# EAGLE design main (EAGLE 9.2.2)
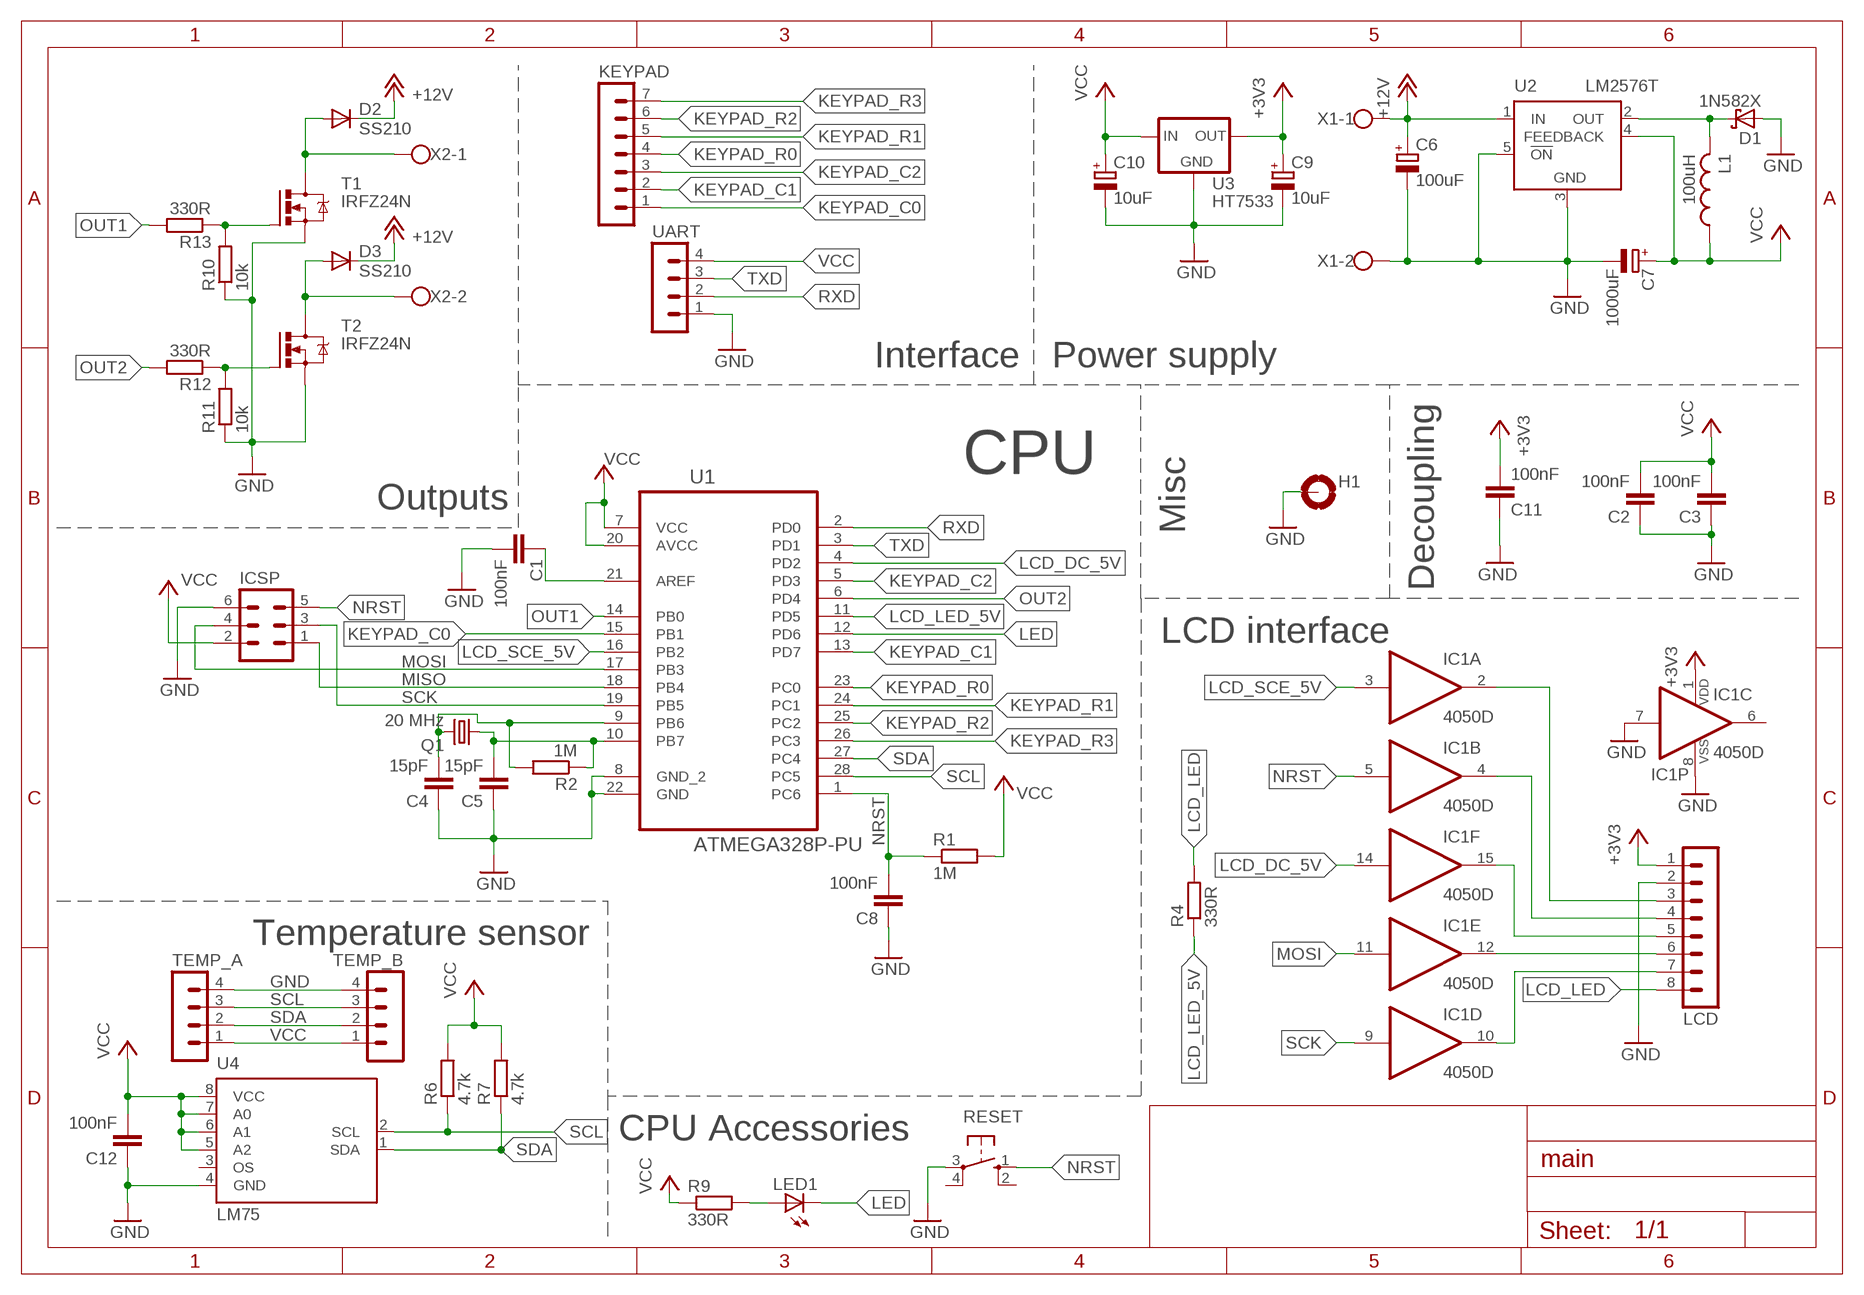
[diagram p0: schematic, sheet 1]

## Parts
C1  100nF  C-EUC0805  [C0805]
C2  100nF  C-EUC0805  [C0805]
C3  100nF  C-EUC0805  [C0805]
C4  15pF  C-EUC0805  [C0805]
C5  15pF  C-EUC0805  [C0805]
C6  100uF  CPOL-EUTAP5-80  [TAP5-80]
C7  1000uF  CPOL-EUTT5D10  [TT5D10]
C8  100nF  C-EUC0805  [C0805]
C9  10uF  CPOL-EUC  [PANASONIC_C]
C10  10uF  CPOL-EUC  [PANASONIC_C]
C11  100nF  C-EUC0805  [C0805]
C12  100nF  C-EUC0805  [C0805]
D1  1N582X  [DIODE5MM]
D2  SS210  DIODE-SMB  [SMB]
D3  SS210  DIODE-SMB  [SMB]
H1  MOUNT-PAD-ROUND3.6  [3,6-PAD]
IC1  4050D  [SO16]
ICSP  MA03-2  [MA03-2]
KEYPAD  MA07-1  [MA07-1]
L1  100uH  L-USTJ3-U1  [TJ3-U1]
LCD  MA08-1  [MA08-1]
LED1  LED5MM  [LED5MM]
Q1  20 MHz  CRYSTALHC49S  [HC49/S]
R1  1M  R-EU_R0805  [R0805]
R2  1M  R-EU_R0805  [R0805]
R4  330R  R-EU_R0805  [R0805]
R6  4.7k  R-EU_R0805  [R0805]
R7  4.7k  R-EU_R0805  [R0805]
R9  330R  R-EU_R0805  [R0805]
R10  10k  R-EU_R0805  [R0805]
R11  10k  R-EU_R0805  [R0805]
R12  330R  R-EU_R0805  [R0805]
R13  330R  R-EU_R0805  [R0805]
RESET  10-XX  [B3F-10XX]
T1  IRFZ24N  [TO220AB]
T2  IRFZ24N  [TO220AB]
TEMP_A  MA04-1  [MA04-1]
TEMP_B  MA04-1  [MA04-1]
U1  ATMEGA328P-PU  [DIP254P762X457-28]
U2  LM2576T  [TO220-5]
U3  HT7533  LE33CZ  [TO-92]
U4  LM75  [SOIC8]
UART  MA04-1  [MA04-1]
X1  W237-102  [W237-102]
X2  W237-102  [W237-102]

## Nets
+3V3: C9.+ C11.2 IC1.1(P:VDD) LCD.1 U3.3(OUT)
+12V: C6.+ D2.C D3.C U2.1(IN) X1.1
GND: C1.2 C2.1 C3.1 C4.1 C5.1 C6.- C7.- C8.1 C9.- C10.- C11.1 C12.1 D1.A H1.B3,6(MOUNT) IC1.7(C:I) IC1.8(P:VSS) ICSP.6 LCD.2 R10.1 R11.1 RESET.3(P) T1.S T2.S TEMP_A.4 TEMP_B.4 U1.8(GND_2) U1.22(GND) U2.3(GND) U2.5(!ON) U3.1(GND) U4.4(GND) UART.1 X1.2
KEYPAD_C0: KEYPAD.1 U1.15(PB1)
KEYPAD_C1: KEYPAD.2 U1.13(PD7)
KEYPAD_C2: KEYPAD.3 U1.5(PD3)
KEYPAD_R0: KEYPAD.4 U1.23(PC0)
KEYPAD_R1: KEYPAD.5 U1.24(PC1)
KEYPAD_R2: KEYPAD.6 U1.25(PC2)
KEYPAD_R3: KEYPAD.7 U1.26(PC3)
LCD_DC: IC1.15(F:O) LCD.5
LCD_DC_5V: IC1.14(F:I) U1.4(PD2)
LCD_LED: LCD.8 R4.2
LCD_LED_5V: R4.1 U1.11(PD5)
LCD_MOSI: IC1.12(E:O) LCD.6
LCD_RST: IC1.4(B:O) LCD.4
LCD_SCE: IC1.2(A:O) LCD.3
LCD_SCE_5V: IC1.3(A:I) U1.16(PB2)
LCD_SCK: IC1.10(D:O) LCD.7
LED: LED1.K(C) U1.12(PD6)
MISO: ICSP.1 U1.18(PB4)
MOSI: IC1.11(E:I) ICSP.4 U1.17(PB3)
N$1: C1.1 U1.21(AREF)
N$3: C5.2 Q1.1 R2.1 U1.10(PB7)
N$4: C4.2 Q1.2 R2.2 U1.9(PB6)
N$6: LED1.A R9.2
N$9: R10.2 R13.1 T1.G
N$12: R11.2 R12.1 T2.G
NRST: C8.2 IC1.5(B:I) ICSP.5 R1.1 RESET.1(S) U1.1(PC6)
OUT1: R13.2 U1.14(PB0)
OUT1_OC: D2.A T1.D X2.1
OUT2: R12.2 U1.6(PD4)
OUT2_OC: D3.A T2.D X2.2
OUT_5V: D1.C L1.2 U2.2(OUT)
RXD: U1.2(PD0) UART.2
SCK: IC1.9(D:I) ICSP.3 U1.19(PB5)
SCL: R6.1 TEMP_A.3 TEMP_B.3 U1.28(PC5) U4.2(SCL)
SDA: R7.1 TEMP_A.2 TEMP_B.2 U1.27(PC4) U4.1(SDA)
TXD: U1.3(PD1) UART.3
VCC: C2.2 C3.2 C7.+ C10.+ C12.2 ICSP.2 L1.1 R1.2 R6.2 R7.2 R9.1 TEMP_A.1 TEMP_B.1 U1.7(VCC) U1.20(AVCC) U2.4(FEEDBACK) U3.2(IN) U4.5(A2) U4.6(A1) U4.7(A0) U4.8(VCC) UART.4
Unconnected: IC1.6(C:O) RESET.2(S1) RESET.4(P1) U4.3(OS)

## Notes on the sheet
- Interface | Power supply
- Decoupling
- Misc
- CPU
- Outputs
- LCD interface
- Temperature sensor
- CPU Accessories

## Library data of the parts
C1-C5 C8 C11 C12 = rcl:C-EU: CAPACITOR, European symbol
C6 C7 C9 C10 = rcl:CPOL-EU: POLARIZED CAPACITOR, European symbol
D1 = misc:1N582X
D2 D3 = diode:DIODE-: DIODE
H1 = holes:MOUNT-PAD-ROUND: MOUNTING PAD, round
IC1 = 40xx:4050: Hex non-inverting BUFFER
ICSP = con-lstb:MA03-2: PIN HEADER; OC_FARNELL: unknown; OC_NEWARK: unknown
KEYPAD = con-lstb:MA07-1: PIN HEADER; OC_FARNELL: unknown; OC_NEWARK: unknown
L1 = rcl:L-US: INDUCTOR, American symbol
LCD = con-lstb:MA08-1: PIN HEADER; OC_FARNELL: unknown; OC_NEWARK: unknown
LED1 = led:LED: LED OSRAM: - CHIPLED LG R971, LG N971, LY N971, LG Q971, LY Q971, LO R971, LY R971 LH N974, LH R974 LS Q976, LO Q976, LY Q976 LO Q996 - Hyper CHIPLED LW Q18S LB Q993, LB Q99A, LB R99A - SideLED LS A670, LO A670, LY A670, LG A670, LP A670 LB A673, LV A673, LT A673, LW A673 LH A674 LY A675 LS A676, LA A676, LO A676, LY A676, LW A676 LS A679, LY A679, LG A679 - Hyper Micro SIDELED® LS Y876, LA Y876, LO Y876, LY Y876 LT Y87S - SmartLED LW L88C, LW L88S LB L89C, LB L89S, LG L890 LS L89K, LO L89K, LY L89K LS L896, LA L896, LO L896, LY L896 - TOPLED LS T670, LO T670, LY T670, LG T670, LP T670 LSG T670, LSP T670, LSY T670, LOP T670, LYG T670 LG T671, LOG T671, LSG T671 LB T673, LV T673, LT T673, LW T673 LH T674 LS T676, LA T676, LO T676, LY T676, LB T676, LH T676, LSB T676, LW T676 LB T67C, LV T67C, LT T67C, LS T67K, LO T67K, LY T67K, LW E67C LS E67B, LA E67B, LO E67B, LY E67B, LB E67C, LV E67C, LT E67C LW T67C LS T679, LY T679, LG T679 LS T770, LO T770, LY T770, LG T770, LP T770 LB T773, LV T773, LT T773, LW T773 LH T774 LS E675, LA E675, LY E675, LS T675 LS T776, LA T776, LO T776, LY T776, LB T776 LHGB T686 LT T68C, LB T68C - Hyper Mini TOPLED® LB M676 - Mini TOPLED Santana® LG M470 LS M47K, LO M47K, LY M47K Source: http://www.osram.convergy.de LUXEON: - LUMILED® LXK2-PW12-R00, LXK2-PW12-S00, LXK2-PW14-U00, LXK2-PW14-V00 LXK2-PM12-R00, LXK2-PM12-S00, LXK2-PM14-U00 LXK2-PE12-Q00, LXK2-PE12-R00, LXK2-PE12-S00, LXK2-PE14-T00, LXK2-PE14-U00 LXK2-PB12-K00, LXK2-PB12-L00, LXK2-PB12-M00, LXK2-PB14-N00, LXK2-PB14-P00, LXK2-PB14-Q00 LXK2-PR12-L00, LXK2-PR12-M00, LXK2-PR14-Q00, LXK2-PR14-R00 LXK2-PD12-Q00, LXK2-PD12-R00, LXK2-PD12-S00 LXK2-PH12-R00, LXK2-PH12-S00 LXK2-PL12-P00, LXK2-PL12-Q00, LXK2-PL12-R00 Source: www.luxeon.com KINGBRIGHT: KA-3528ASYC Source: www.kingbright.com
Q1 = crystal:CRYSTAL: CRYSTAL; OC_FARNELL: 1667008; OC_NEWARK: unknown
R1 R2 R4 R6 R7 R9-R13 = rcl:R-EU_: RESISTOR, European symbol
RESET = switch-omron:10-XX: OMRON SWITCH; MPN: B3F-1000; OC_FARNELL: 176432; OC_NEWARK: 36M3542
T1 T2 = misc:IRFZ24N
TEMP_A TEMP_B UART = con-lstb:MA04-1: PIN HEADER; OC_FARNELL: unknown; OC_NEWARK: unknown
U1 = ATMEGA328P-PU:ATMEGA328P-PU: 8-bit Microcontroller with In-System Programmable Flash; MPN: ATMEGA328P-PU; OC_FARNELL: 1715487; OC_NEWARK: 15R0268; PACKAGE: PDIP-28; SUPPLIER: Atmel
U2 = misc:LM2576T
U3 = v-reg:LE33CZ
U4 = misc:LM75
X1 X2 = con-wago-500:W237-102: WAGO SCREW CLAMP; MPN: 237-102; OC_FARNELL: unknown; OC_NEWARK: 70K9898

## Board
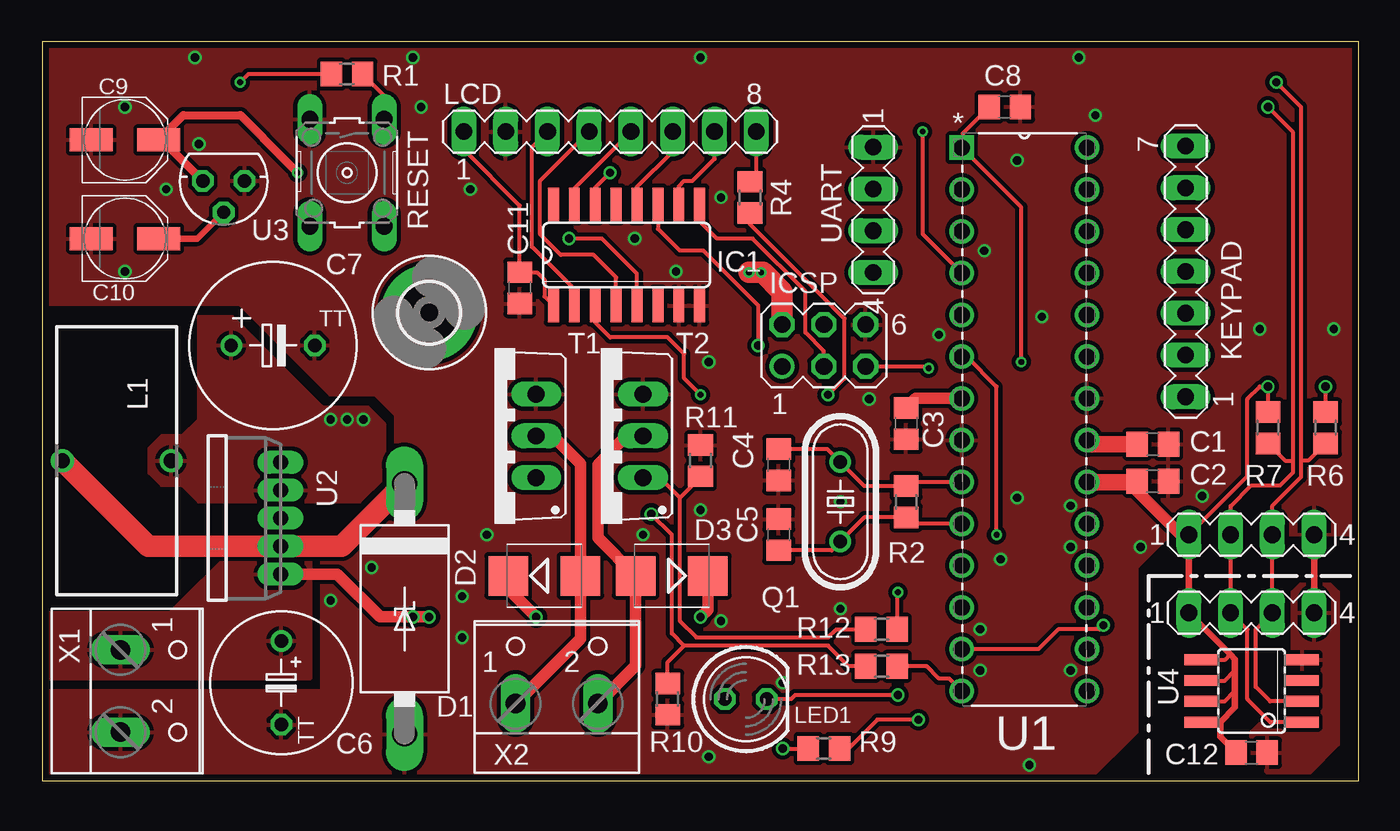
[diagram p1: board, top side]
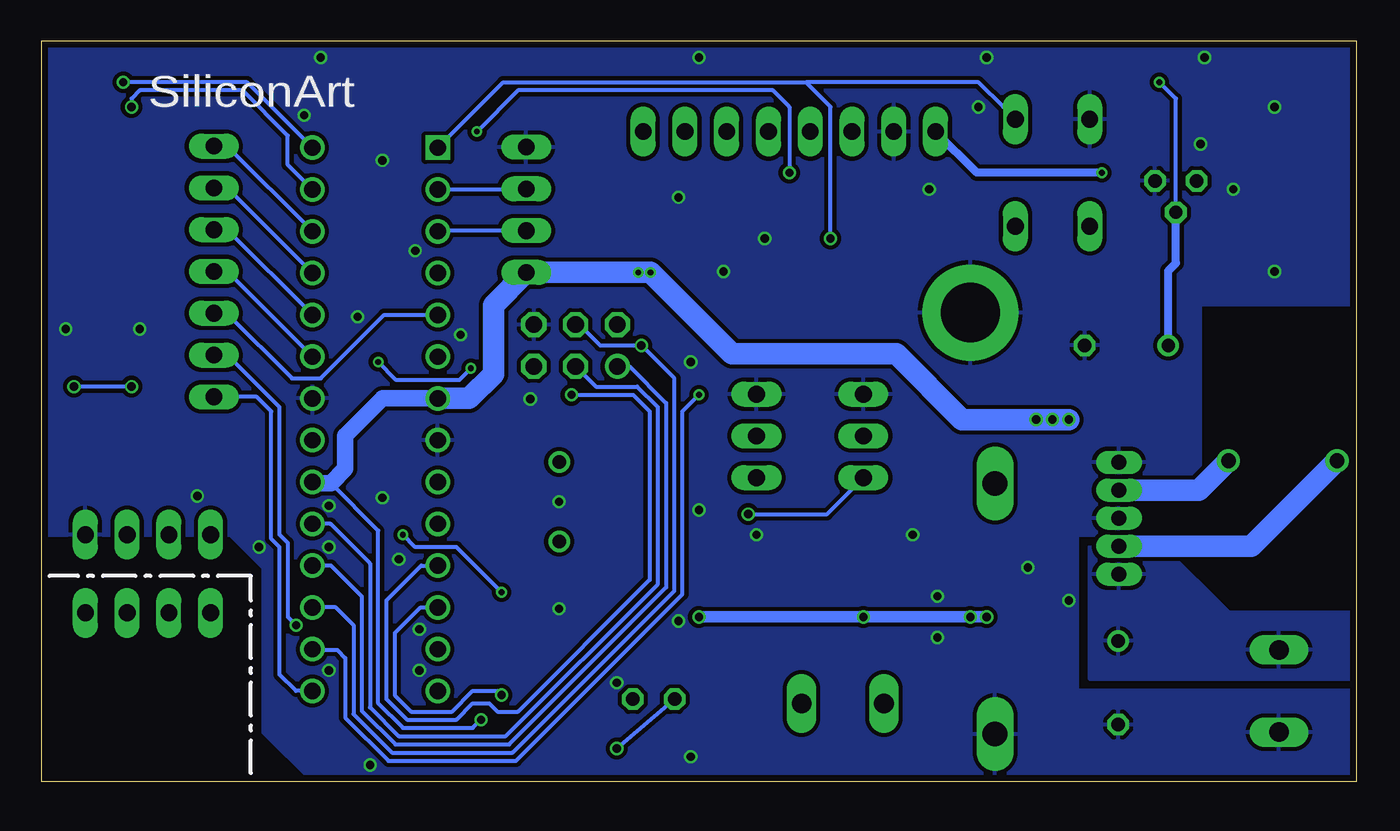
[diagram p2: board, bottom side, seen from below]

Size 80 x 45 mm. Coordinates in mm from the lower left corner, seen from the top.
Outline: 0,0 0,45 80,45 80,0 0,0
Copper layers (1*16): Top 0.035mm / dielectric 1.6mm / Bottom 0.035mm
Design rules "iteadstudio": minimum track width 0.2mm, minimum drill 0.3mm, track to track 0.25mm, track to pad 0.25mm, pad to pad 0.25mm, via to via 0.25mm, smd to smd 0.15mm, copper to edge 0.4mm, drill to drill 0.25mm, minimum pad ring 0.25mm, minimum via ring 0.15mm, stop-mask expansion 0.1mm, vias tented up to drill 0mil, thermal gap 0.25mm

### Footprints (pad centres in the part's own frame; a part is rotated, then mirrored left to right if it is on the bottom)
C0805 = smd 1.3 x 1.5: 1 -0.95,0; 2 0.95,0
TAP5-80 = drill 0.813: + -2.54,0 | drill 0.813 octagon: - 2.54,0
TT5D10 = drill 0.813: + -2.54,0 | drill 0.813 octagon: - 2.54,0
PANASONIC_C = smd 2.6 x 1.4: + 2.05,0; - -2.05,0
DIODE5MM = drill 1.499 long: A 7.62,0; C -7.62,0
SMB = smd 2.4 x 2.4: A 2.2,0; C -2.2,0
3,6-PAD = drill 3.6 pad 5.842: B3,6 0,0
SO16 = smd 0.66 x 2.032: 1 -4.445,-3.073; 2 -3.175,-3.073; 3 -1.905,-3.073; 4 -0.635,-3.073; 5 0.635,-3.073; 6 1.905,-3.073; 7 3.175,-3.073; 8 4.445,-3.073; 9 4.445,3.073; 10 3.175,3.073; 11 1.905,3.073; 12 0.635,3.073; 13 -0.635,3.073; 14 -1.905,3.073; 15 -3.175,3.073; 16 -4.445,3.073
MA03-2 = drill 1.016: 1 -2.54,-1.27 | drill 1.016 octagon: 2 -2.54,1.27; 3 0,-1.27; 4 0,1.27; 5 2.54,-1.27; 6 2.54,1.27
MA07-1 = drill 1.016 long: 1 -7.62,0; 2 -5.08,0; 3 -2.54,0; 4 0,0; 5 2.54,0; 6 5.08,0; 7 7.62,0
TJ3-U1 = drill 0.9: 1 -3.3,0; 2 3.3,0
MA08-1 = drill 1.016 long: 1 -8.89,0; 2 -6.35,0; 3 -3.81,0; 4 -1.27,0; 5 1.27,0; 6 3.81,0; 7 6.35,0; 8 8.89,0
LED5MM = drill 0.813 octagon: A -1.27,0; K 1.27,0
HC49/S = drill 0.813: 1 -2.413,0; 2 2.413,0
R0805 = smd 1.3 x 1.5: 1 -0.95,0; 2 0.95,0
B3F-10XX = drill 1.016 long: 1 -3.251,2.261; 2 3.251,2.261; 3 -3.251,-2.261; 4 3.251,-2.261
TO220AB = drill 1.016 long: D 0,0; G -2.54,0; S 2.54,0
MA04-1 = drill 1.016 long: 1 -3.81,0; 2 -1.27,0; 3 1.27,0; 4 3.81,0
DIP254P762X457-28 = drill 0.991 square: 1 -7.62,33.02 | drill 0.991: 2 -7.62,30.48; 3 -7.62,27.94; 4 -7.62,25.4; 5 -7.62,22.86; 6 -7.62,20.32; 7 -7.62,17.78; 8 -7.62,15.24; 9 -7.62,12.7; 10 -7.62,10.16; 11 -7.62,7.62; 12 -7.62,5.08; 13 -7.62,2.54; 14 -7.62,0; 15 0,0; 16 0,2.54; 17 0,5.08; 18 0,7.62; 19 0,10.16; 20 0,12.7; 21 0,15.24; 22 0,17.78; 23 0,20.32; 24 0,22.86; 25 0,25.4; 26 0,27.94; 27 0,30.48; 28 0,33.02
TO220-5 = drill 0.9 long: 1 -3.4,-1.96; 2 -1.7,-1.96; 3 0,-1.96; 4 1.7,-1.96; 5 3.4,-1.96
TO-92 = drill 0.813 octagon: 1 -1.27,0; 2 0,1.905; 3 1.27,0
SOIC8 = smd 0.66 x 2.032: 1 -1.905,-3.073; 2 -0.635,-3.073; 3 0.635,-3.073; 4 1.905,-3.073; 5 1.905,3.073; 6 0.635,3.073; 7 -0.635,3.073; 8 -1.905,3.073
W237-102 = drill 1.194 long: 1 -2.5,-1.27; 2 2.5,-1.27

### Placement (x,y rotation side)
C1  67.5,20.5 0 top
C2  67.5,18.25 180 top
C3  52.5,21.75 90 top
C4  44.75,19.25 90 top
C5  44.75,15 270 top
C6  14.5,6 270 top
C7  14,26.5 0 top
C8  58.5,41 180 top
C9  5,39 0 top
C10  5,33 0 top
C11  29,30 90 top
C12  73.5,1.75 180 top
D1  22,10.5 270 top
D2  30.5,12.5 0 top
D3  38.25,12.5 180 top
H1  23.5,28.5 0 top
IC1  35.5,32 0 top
ICSP  47.5,26.5 0 top
KEYPAD  69.5,31 90 top
L1  4.5,19.5 180 top
LCD  34.5,39.5 0 top
LED1  42.75,5 0 top
Q1  48.5,17 90 top
R1  18.5,43 180 top
R2  52.5,17 90 top
R4  43,35.5 90 top
R6  78,21.5 90 top
R7  74.5,21.5 90 top
R9  47.5,2 180 top
R10  38,5 90 top
R11  40,19.5 270 top
R12  51,9.25 0 top
R13  51,7 0 top
RESET  18.5,37 270 top
T1  30,21 90 top
T2  36.5,21 90 top
TEMP_A  73.5,10.25 0 top
TEMP_B  73.5,15 0 top
U1  63.5,5.5 0 top
U2  12.5,16 90 top
U3  11,36.5 180 top
U4  73.5,5.5 90 top
UART  50.5,34.75 270 top
X1  6,5.5 270 top
X2  31.25,6 0 top

### Tracks (layer width: path | path; a pad name or v marks a point on that pad's centre or on a via)
+3V3  (via drill 0.35)
  Top 0.25: IC1.1 30.5,29.48 30.5,30.5 30.05,30.95 C11.2 29,35 25.61,38.39 LCD.1
  Top 0.5: U3.3 7.23,39 C9.+ 8.55,40.5 12.02,40.5 13.4,39.12 13.4,39.1 v15.5,37
  Bottom 0.5: v15.5,37 23.11,37 LCD.1
+12V  (via drill 0.5)
  Top 0.7: D2.C 28.3,11.7 v30,10 | v40,10 40.45,10.45 D3.C | U2.1 17.9,12.6 20.5,10 v22.5,10 v23.5,10
  Bottom 0.7: v40,10 v30,10 v23.5,10 v22.5,10
  pour Top: 0,10.25 7.75,10.25 11.75,14.25 16.25,14.25 16.25,6.25 0,6.25
  pour Bottom: 0,10.25 7.75,10.25 11.75,14.25 16.25,14.25 16.25,6.25 0,6.25
GND  (via drill 0.5)
  Top 0.4: TEMP_A.4 TEMP_B.4
  other vias: 63,44 64,40.5 20,13 48.5,17 23,41 26,36 40,44 9.5,38.75 5,41 5,31 9.25,44 62.5,6.75 60.75,28.25 41.25,35.5 17.5,11 59.25,37.75 48.5,10.5 45,6 40.5,1.5 7.5,36 57.25,32.25 41.25,9.75 27,15 36.5,15 40,16.5 38.5,31 36,33 25.5,11.25 25.5,8.75 57,9.25 50.25,23.25 70.5,17.35 57,6.75 78.5,27.5 74,27.5 58.25,13.5 60,1 62.5,14.25 66.75,14.25 59.25,17.25 62.5,16.75 54.5,27.15 22.5,44 40.5,25.5
  pour Top: 0,45 80,45 80,15 68.5,15 66.5,13 66.5,3 63.5,0 0,0 0,5.5 17,5.5 17,16.5 21.5,16.5 21.5,22.25 20.25,23.5 17.5,23.5 12,29 0,29
  pour Bottom: 0,45 80,45 80,15 68.5,15 66.5,13 66.5,3 63.5,0 0,0 0,5.5 17,5.5 17,15 14.5,15 14.5,17.5 9.5,17.5 9.5,29 0,29
  pour Top: 76.5,12 78.25,12 78.75,11.5 78.75,2.25 77,0.5 74.5,0.5 73.5,1.5 73.5,3 76,5.5 76,11.5
KEYPAD_C0
  Bottom 0.25: KEYPAD.1 66.88,23.38 66,22.5 66,14.75 65.5,14.25 65.5,6.5 64.5,5.5 U1.15
KEYPAD_C1  (via drill 0.5 pad 0.8)
  Top 0.25: v64.5,9.5 64.25,9.25 61.75,9.25 60.54,8.04 U1.13
  Bottom 0.25: KEYPAD.2 68.67,25.92 65.5,22.75 65.5,15 65,14.5 65,10 v64.5,9.5
KEYPAD_C2
  Bottom 0.25: KEYPAD.3 68.71,28.46 64.75,24.5 63,24.5 59.14,28.36 U1.5
KEYPAD_R0
  Bottom 0.25: U1.23 68.68,31 KEYPAD.4
KEYPAD_R1
  Bottom 0.25: U1.24 68.68,33.54 KEYPAD.5
KEYPAD_R2
  Bottom 0.25: U1.25 68.68,36.08 KEYPAD.6
KEYPAD_R3
  Bottom 0.25: U1.26 68.68,38.62 KEYPAD.7
LCD_DC
  Top 0.25: IC1.15 32.33,36.05 LCD.5
LCD_DC_5V  (via drill 0.35, 0.5)
  Top 0.25: IC1.14 33.59,36.09 v34.5,37 | v53.5,39.5 53.5,33.28 U1.4
  Bottom 0.25: v34.5,37 34.5,41 35.5,42 51,42 v53.5,39.5
LCD_LED
  Top 0.25: R4.2 43.39,37.06 LCD.8
LCD_LED_5V  (via drill 0.5)
  Top 0.25: v47.75,23.5 48.75,24.5 48.75,28.13 43,33.88 R4.1
  Bottom 0.25: v47.75,23.5 44,23.5 43,22.5 43,12.25 51,4.25 52.25,4.25 52.75,4.75 53.75,4.75 54.75,3.75 57.75,3.75 59,5 59,11 56.88,13.12 U1.11
LCD_MOSI
  Top 0.25: IC1.12 36.13,36.13 38.31,38.31 LCD.6
LCD_RST
  Top 0.25: IC1.4 34.87,30.64 33.5,32 31.5,32 30.25,33.25 30.25,36.52 LCD.4
LCD_SCE
  Top 0.25: IC1.2 32.33,29.93 29.75,32.5 29.75,38.56 LCD.3
LCD_SCE_5V  (via drill 0.35)
  Top 0.25: v40,23.5 39,24.5 39,26 38,27 34.5,27 33.59,27.91 IC1.3
  Bottom 0.25: U1.16 63.46,8 62,8 61.5,7.5 61.5,3.88 58.87,1.25 51.13,1.25 41,11.38 41,22.5 v40,23.5
LCD_SCK
  Top 0.25: IC1.10 38.67,36.17 39,36.5 39.5,36.5 40.85,37.85 LCD.7
LED  (via drill 0.5)
  Top 0.25: v52,5.25 45.75,5.25 45.5,5 LED1.K
  Bottom 0.25: U1.12 56.92,10.58 58.5,9 58.5,5.25 57.5,4.25 55,4.25 53.75,5.5 52.25,5.5 v52,5.25
MISO
  Bottom 0.25: ICSP.1 44.23,25.23 42,23 42,11.79 51.54,2.25 58.46,2.25 60.5,4.29 60.5,11.25 62.37,13.12 U1.18
MOSI  (via drill 0.5)
  Top 0.25: IC1.11 37.41,33.59 38.73,32.27 40.16,32.27 43.5,28.93 v43.5,26.5
  Bottom 0.25: ICSP.4 47.27,27.77 46,26.5 v43.5,26.5 41.5,24.5 41.5,11.59 51.34,1.75 58.66,1.75 61,4.09 61,9.5 62.08,10.58 U1.17
N$1
  Top 1: C1.1 63.74,20.5 U1.21
N$3
  Top 0.25: U1.10 52.89,15.66 R2.1 49.96,16.05 Q1.1 47.96,14.05 C5.2
N$4
  Top 0.25: U1.9 52.75,18.2 R2.2 49.96,17.95 Q1.2 47.71,20.2 C4.2
N$6  (via drill 0.5)
  Top 0.25: v45,2 R9.2
  Bottom 0.25: LED1.A 41.5,5 v45,2
N$9  (via drill 0.5)
  Top 0.25: R13.1 49,7 47.75,8.25 39,8.25 | 39,8.25 38.25,9 38.25,15 v37,16.25 | R10.2 38,7.25 39,8.25
  Bottom 0.25: v37,16.25 32.21,16.25 T1.G
N$12
  Top 0.25: 38.75,17.25 38.75,9.75 39.75,8.75 47.75,8.75 48.25,9.25 R12.1 | 38.75,17.25 37.54,18.46 T2.G | 38.75,17.25 40,18.5 R11.2
NRST  (via drill 0.35, 0.5)
  Top 0.25: IC1.5 36.13,30.86 34,33 v32,33 | 55.95,38.45 59.5,34.9 v59.5,25.5 | 55.95,38.45 U1.1 | R1.1 20.76,41.69 RESET.1 | C8.2 55.95,39.4 55.95,38.45 | ICSP.5 53.75,25.23 v53.87,25.12
  Bottom 0.25: 33.5,42.5 23,42.5 21.5,41 21,40.49 RESET.1 | v32,33 32,41 33.5,42.5 | U1.1 51.9,42.5 33.5,42.5 | v53.87,25.12 54.58,24.4 58.4,24.4 v59.5,25.5
OUT1
  Top 0.25: U1.14 55.13,6.25 54.5,6.25 53.75,7 R13.2
OUT1_OC
  Top 0.7: T1.D 31,21 32.7,19.3 D2.A 32.7,8.68 X2.1
OUT2  (via drill 0.35)
  Top 0.25: v52,11.5 51.95,11.45 R12.2 | v58,15 58,24 56.18,25.82 U1.6
  Bottom 0.25: v52,11.5 54.75,14.25 57.25,14.25 v58,15
OUT2_OC
  Top 0.7: T2.D 35.5,21 33.75,19.25 33.75,14.8 D3.A 36.05,7.03 X2.2
OUT_5V
  Top 1.3: D1.C 18.18,14.3 U2.2 6.4,14.3 L1.2
  Bottom 1.3: L1.2 6.4,14.3 U2.2
RXD
  Bottom 0.25: UART.2 50.54,35.98 U1.2
SCK
  Top 0.25: IC1.9 40,35.02 40,34 41,33 43.17,33 46.36,29.81 46.36,27.3 47.5,26.16 ICSP.3
  Bottom 0.25: ICSP.3 46.27,24 43.75,24 42.5,22.75 42.5,12 51.75,2.75 58.25,2.75 60,4.5 60,13.25 62.41,15.66 U1.19
SCL  (via drill 0.5 pad 0.8)
  Top 0.25: U4.2 74.64,4.87 73.75,5.75 73.75,9.23 TEMP_A.3 TEMP_B.3 74.77,16.77 76.5,18.5 76.5,19.5 | 76.5,19.5 76.5,41 v75,42.5 | R6.1 76.95,19.5 76.5,19.5
  Bottom 0.25: U1.28 67.48,42.5 v75,42.5
SDA  (via drill 0.5 pad 0.8)
  Top 0.25: U4.1 74.66,3.6 73.25,5 73.25,9.23 TEMP_A.2 TEMP_B.2 72.23,16.73 73.5,18 75.25,18 76,18.75 76,19.5 | 76,19.5 76,39.5 v74.5,41 | R7.1 75.55,19.5 76,19.5
  Bottom 0.25: U1.27 65,37.48 65,39.25 67.75,42 74,42 74.5,41.5 v74.5,41
TXD
  Bottom 0.25: UART.3 55.84,33.48 U1.3
VCC  (via drill 0.35, 0.5, 0.5 pad 0.8)
  Top 0.25: v53.25,3.75 50.75,3.75 49,2 R9.1 | U4.7 71.86,4.87 72.5,5.5 | U4.6 71.89,6.13 72.5,6.75 | U4.5 71.91,7.41 72.22,7.72 | R7.2 v74.5,24 74,24 73.25,23.25 73.25,18.56 TEMP_B.1 | v78,24 R6.2 | R1.2 12.5,43 v12,42.5 | v43.69,30.94 43.78,30.94
  Top 0.4: C10.+ 9.4,33 U3.2 | TEMP_B.1 TEMP_A.1 72.22,7.72 72.5,7.44 72.5,6.75 72.5,5.5 72.5,4.5 71.59,3.6 | 71.59,3.6 U4.8 | C12.2 71.59,2.71 71.59,3.6
  Top 0.7: U1.7 53.08,23.28 C3.2 | C2.2 66.5,18.2 66,18.2 69.2,15 TEMP_B.1
  Top 1: 66,18.2 U1.20
  Top 1.3: v42.94,30.94 43.78,30.94 44.96,29.76 ICSP.2
  Bottom 0.25: 62.38,18.12 59.5,15.25 59.5,4.75 58,3.25 53.75,3.25 v53.25,3.75 | v74.5,24 v78,24 | U3.2 11,41.5 v12,42.5
  Bottom 0.5: C7.+ 11.46,31.04 11,31.5 U3.2
  Bottom 1: U1.7 59.22,23.28 61.5,21 61.5,19 62.38,18.12 63.42,18.12 U1.20
  Bottom 1.3: U1.7 53.97,23.28 52.5,24.75 52.5,28.94 UART.4 v42.94,30.94 38,26 28,26 24,22 v19.5,22 v17.5,22 v18.5,22 | L1.1 9.6,17.7 U2.4
  pour Top: 9.5,28.25 11.5,28.25 17,22.75 19.75,22.75 20.75,21.75 20.75,18.5 19.25,17 9.5,17 8.5,18 7.25,18 6.5,18.75 6.5,20.25 7.25,21 8.5,21 9.5,22

### Text on the board
bNames: SiliconArt